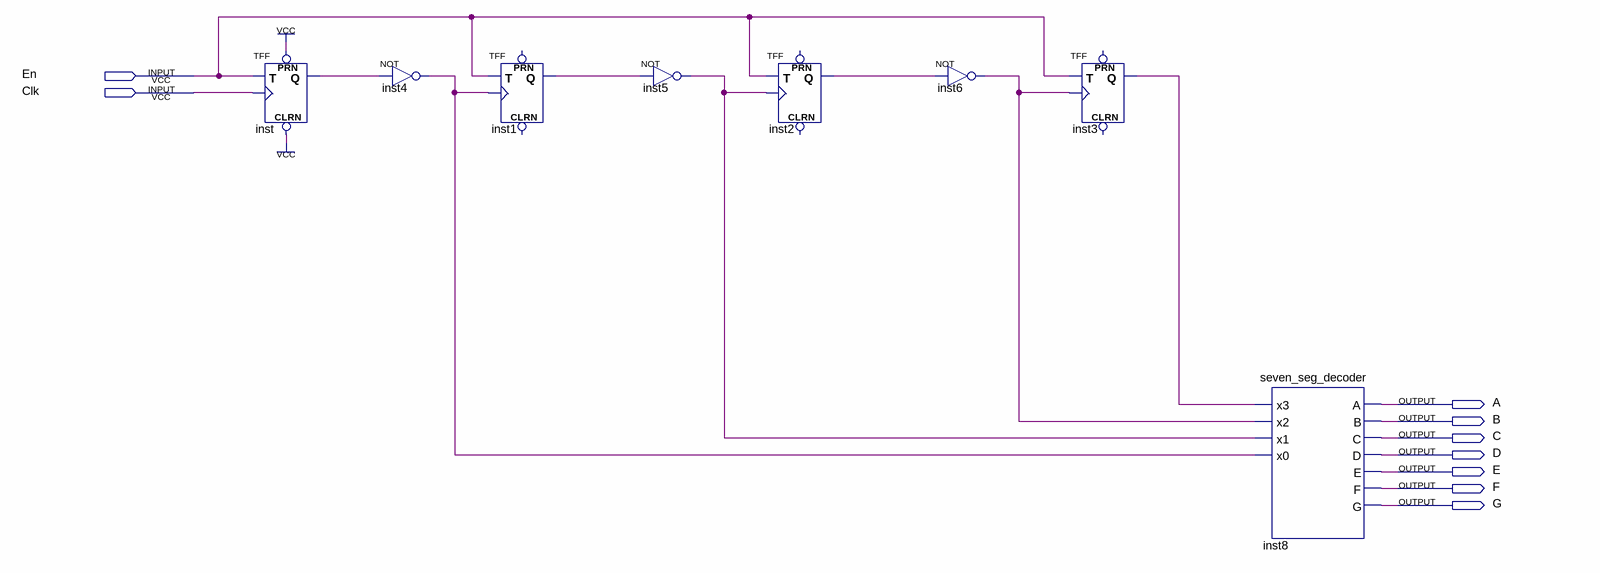
[diagram p0: schematic sheet]
// Quartus schematic lab10step3b.bdf as structural Verilog: 8 symbols, 9 pins
module lab10step3b (
  input  En,
  input  Clk,
  output A,
  output B,
  output C,
  output D,
  output E,
  output F,
  output G
);

  wire inst1_q, inst2_q, inst3_q, inst4_out, inst5_out, inst6_out, inst_q;

  TFF inst (.PRN(1'b1), .CLRN(1'b1), .T(En), .CLK(Clk), .Q(inst_q));
  not inst4 (inst4_out, inst_q);
  TFF inst1 (.T(En), .CLK(inst4_out), .Q(inst1_q));  // open: PRN, CLRN
  not inst5 (inst5_out, inst1_q);
  TFF inst2 (.T(En), .CLK(inst5_out), .Q(inst2_q));  // open: PRN, CLRN
  not inst6 (inst6_out, inst2_q);
  TFF inst3 (.T(En), .CLK(inst6_out), .Q(inst3_q));  // open: PRN, CLRN
  seven_seg_decoder inst8 (
    .x3(inst3_q), .x2(inst6_out), .x1(inst5_out), .x0(inst4_out), .A(A), .B(B), .C(C), .D(D), .E(E), .F(F),
    .G(G));
endmodule
